# Altium schematic sheet Sheet1TASK1.SchDoc
size A; SheetNumber: 1; SheetTotal: 1; SPICEModelCacheAWHYILPY: <root> / <DocumentId>AWHYILPY</DocumentId> / <CacheFrame Number="0"> / <Model Name="cap" Kind="MDL"> / <Text>*Default semiconductor capacitor / .MODEL CAP C()</Text> / </Model> / </CacheFrame> / </root>
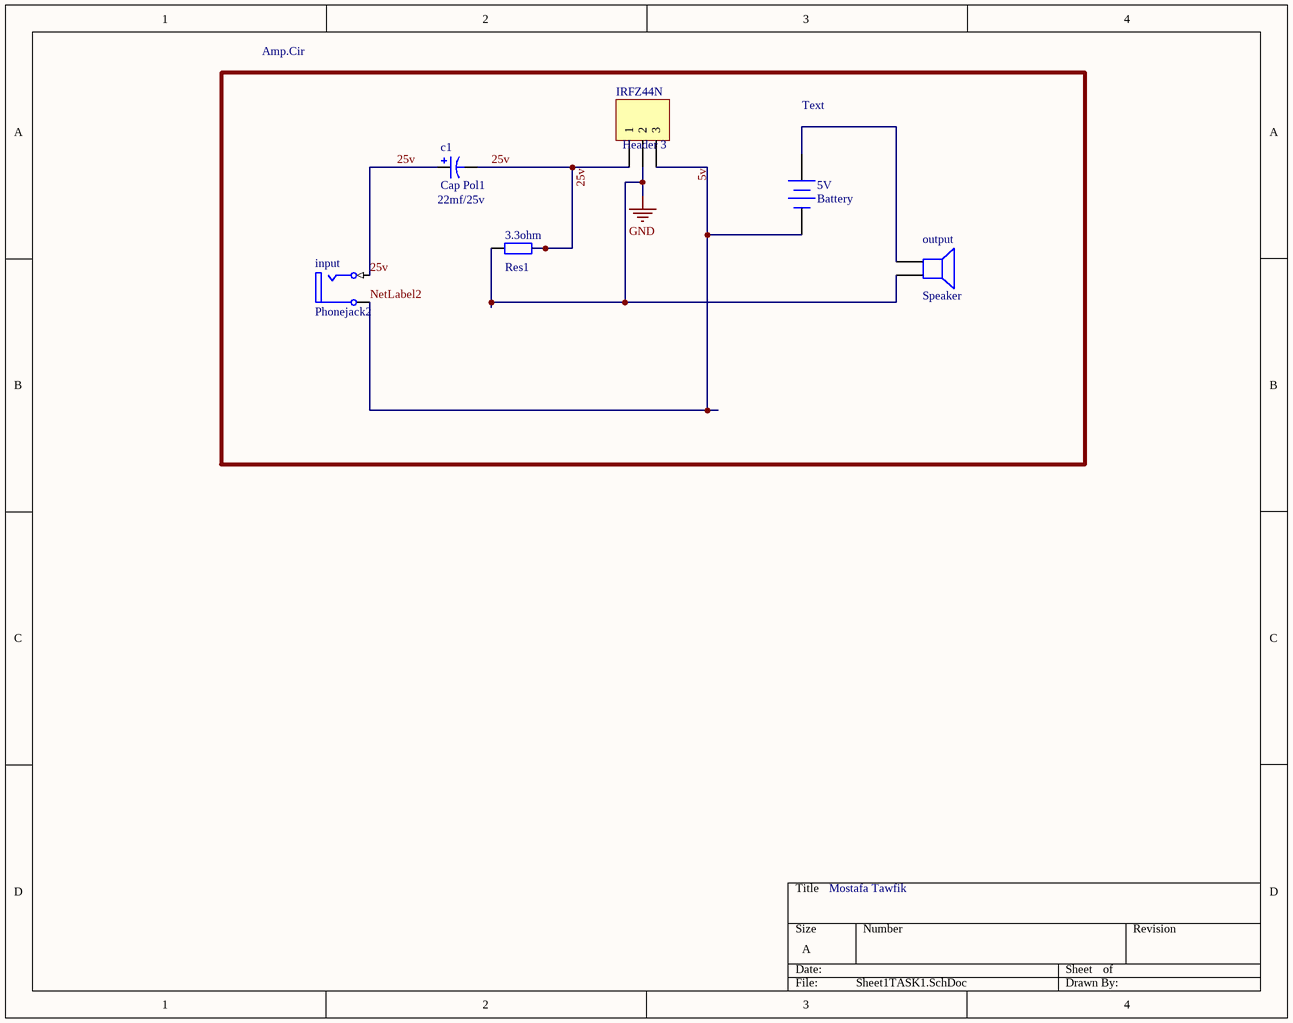
[diagram p0: Sheet1TASK1.SchDoc]

## Parts
3.3ohm  Res1  [AXIAL-0.4]
5V  Battery  [BAT-2]
c1  Cap Pol1  value 22mf/25v  [RB7.6-15]
input  Phonejack2  [JACK/6-V2]
IRFZ44N  Header 3  [HDR1X3]
output  Speaker  [PIN2]

## Nets
GND: 3.3ohm.1 IRFZ44N.2 output.2
5v: 5V.2(-) input.5(S) IRFZ44N.3  [also labelled NetLabel2]
25v: 3.3ohm.2 c1.1 c1.2 input.1(T) IRFZ44N.1
Net5V_1: 5V.1(+) output.1

## Notes on the sheet
- Amp.Cir
- Text
- Mostafa Tawfik

## Library data of the parts
3.3ohm = Res2: Resistor; Published: 8-Jun-2000; LatestRevisionDate: 17-Jul-2002; LatestRevisionNote: Re-released for DXP Platform.; PackageReference: AXIAL-0.4; Publisher: Altium Limited; PackageDescription: Axial Device, Thru-Hole; 2 Leads; 0.4 in Pin Spacing
5V = Battery: Multicell Battery; Published: 24-Mar-1999; LatestRevisionDate: 17-Jul-2002; LatestRevisionNote: Re-released for DXP Platform.; PackageReference: BAT-2; Publisher: Altium Limited; PackageDescription: Battery; 2 Leads
c1 = Cap Pol1: Polarized Capacitor (Radial); Published: 8-Jun-2000; LatestRevisionDate: 17-Jul-2002; LatestRevisionNote: Re-released for DXP Platform.; PackageReference: RB7.6-15; Publisher: Altium Limited; PackageDescription: Polarized Capacitor (Radial); 2 Leads
input = Phonejack2: Jack Socket, 1/4" [6.5mm], Thru-Hole, Vertical, 2-Conductor Open Circuit; PackageDocument: 2003; PCB_Layout: Complies with manufacturer's recommendation.; DrillAndSlotSize: Corresponds to nominal value.; LatestRevisionDate: 15-Jul-2004; LatestRevisionNote: Component Replaced.; DatasheetDocument: 2003; PackageReference: S1VS_SNS; Publisher: Altium Limited; ComponentLink1Description: Manufacturer Link; ComponentLink1URL: http://www.cliffuk.co.uk/
IRFZ44N = Header 3: Header, 3-Pin; LatestRevisionDate: 17-Jul-2002; LatestRevisionNote: Re-released for DXP Platform.; Publisher: Altium Limited
output = Speaker: Loudspeaker; Published: 24-Mar-1999; LatestRevisionDate: 17-Jul-2002; LatestRevisionNote: Re-released for DXP Platform.; PackageReference: PIN2; Publisher: Altium Limited